# Altium project Kanaloa_v2.0.0_Loko.PrjPcb
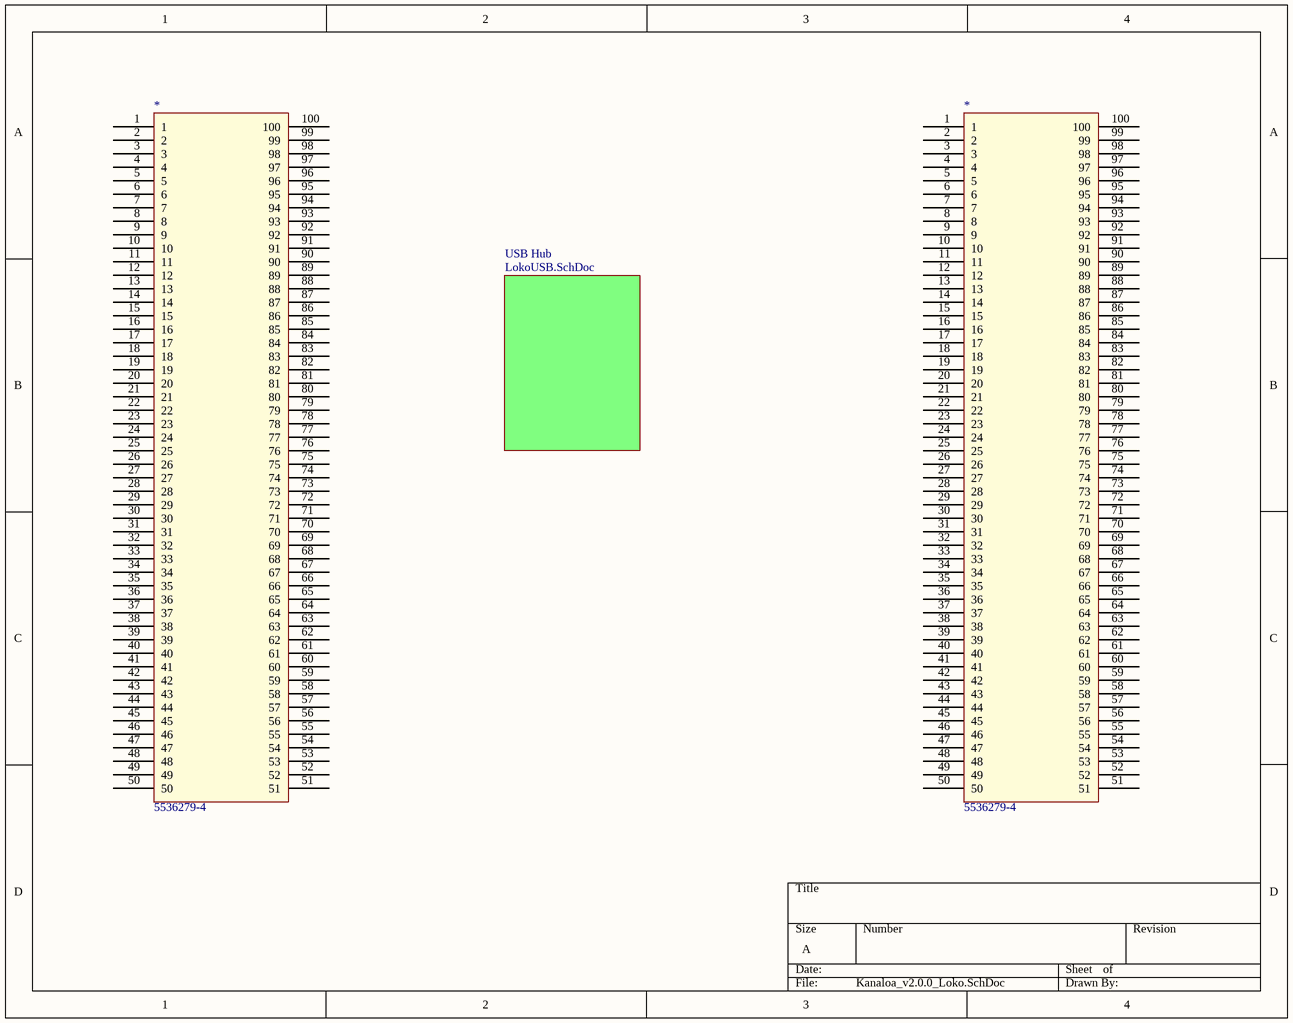
[diagram p0: Kanaloa_v2.0.0_Loko.SchDoc]
2 sheets, 21 parts. Net scope: flat (ports and power ports of the same name join across sheets).
Board file: Kanaloa_v2.0.0_Loko.PcbDoc
Sheets:
  Kanaloa_v2.0.0_Loko.SchDoc
    USB Hub = LokoUSB.SchDoc

## Sheet Kanaloa_v2.0.0_Loko.SchDoc
size A

### Parts
(Parts that share a designator on the sheet are numbered #1, #2 ... from top to bottom, then left to right.)
*#1  5536279-4
*#2  5536279-4

### Sub-sheets
USB Hub = LokoUSB.SchDoc: no entries

### Nets

Not connected (* = marked no-connect by the designer): *#1 1 2 3 4 5 6 7 8 9 10 11 12 13 14 15 16 17 18 19 20 21 22 23 24 25 26 27 28 29 30 31 32 33 34 35 36 37 38 39 40 41 42 43 44 45 46 47 48 49 50 51 52 53 54 55 56 57 58 59 60 61 62 63 64 65 66 67 68 69 70 71 72 73 74 75 76 77 78 79 80 81 82 83 84 85 86 87 88 89 90 91 92 93 94 95 96 97 98 99 100; *#2 1 2 3 4 5 6 7 8 9 10 11 12 13 14 15 16 17 18 19 20 21 22 23 24 25 26 27 28 29 30 31 32 33 34 35 36 37 38 39 40 41 42 43 44 45 46 47 48 49 50 51 52 53 54 55 56 57 58 59 60 61 62 63 64 65 66 67 68 69 70 71 72 73 74 75 76 77 78 79 80 81 82 83 84 85 86 87 88 89 90 91 92 93 94 95 96 97 98 99 100

### Library data of the parts
*#1 *#2 = 5536279-4: female

## Sheet LokoUSB.SchDoc
size Tabloid
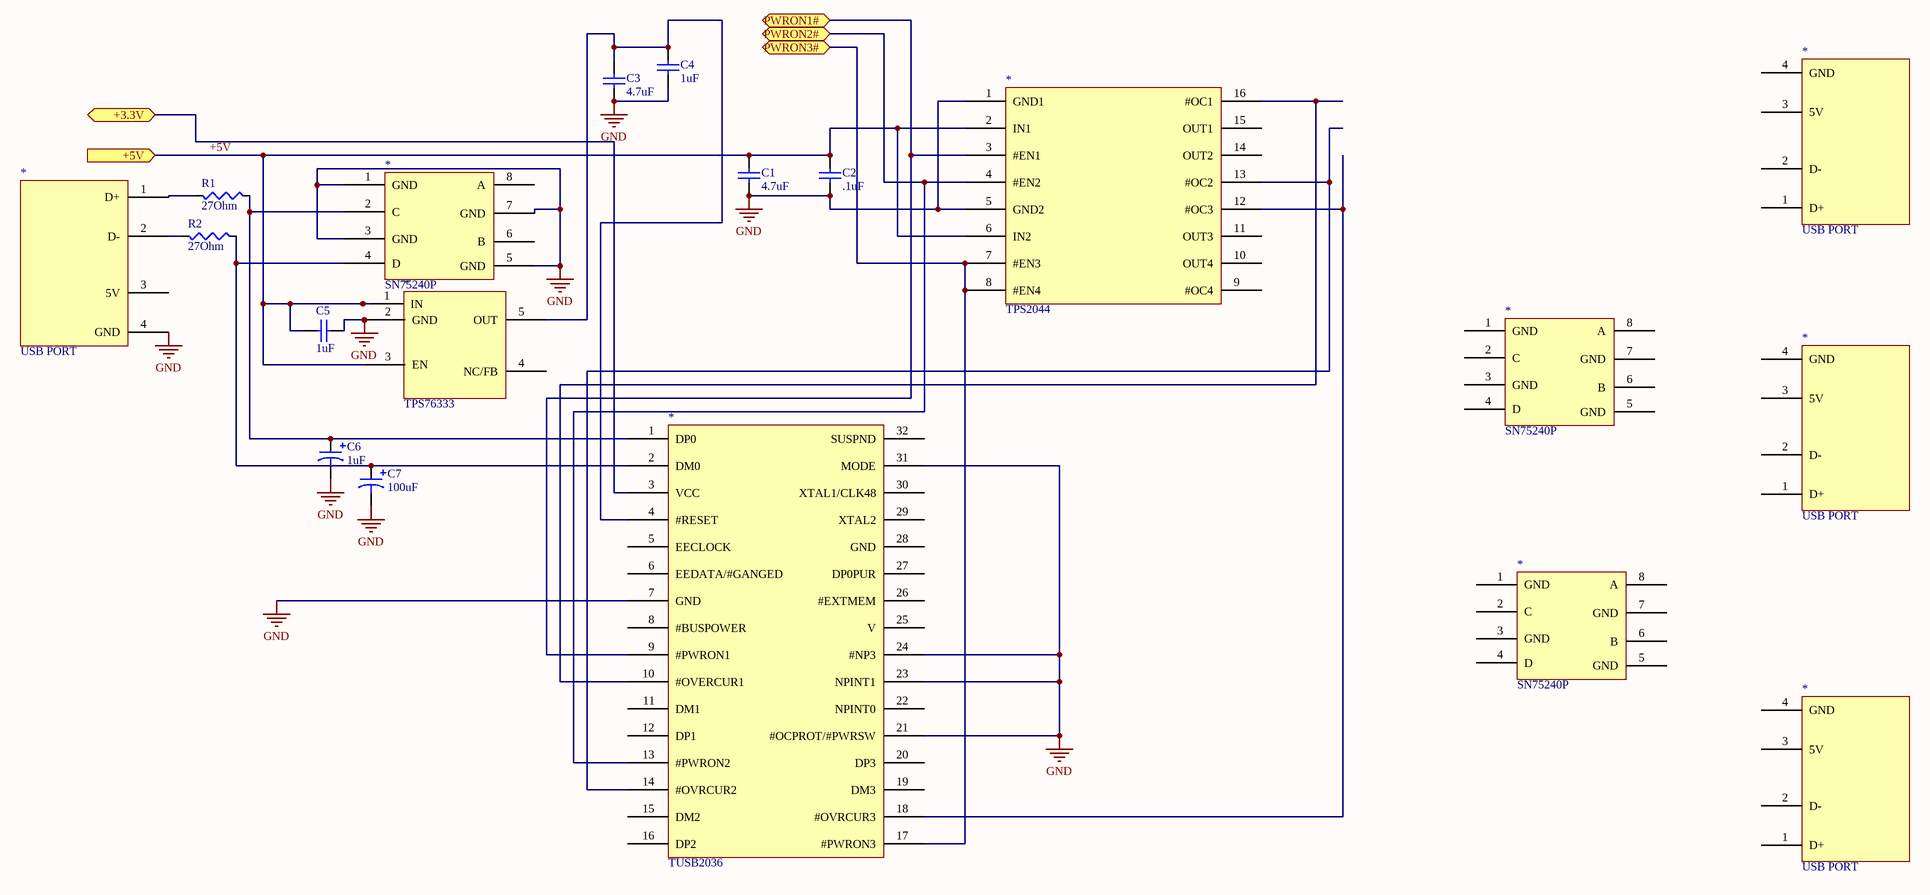
[diagram p1: LokoUSB.SchDoc]

### Parts
(Parts that share a designator on the sheet are numbered #1, #2 ... from top to bottom, then left to right.)
*#3  USB PORT
*#4  TPS2044
*#5  SN75240P
*#6  USB PORT
*#7  TPS76333
*#8  SN75240P
*#9  USB PORT
*#10  SN75240P
*#11  TUSB2036  [TUSB2036]
*#12  USB PORT
C1  4.7uF  [0805 (2012) Capacitor]
C2  .1uF  [0805 (2012) Capacitor]
C3  4.7uF  [0805 (2012) Capacitor]
C4  1uF  [0805 (2012) Capacitor]
C5  1uF  [0805 (2012) Capacitor]
C6  1uF  [Radial (8mm x 15mm, 3.5mm spacing)]
C7  100uF  [Radial (8mm x 15mm, 3.5mm spacing)]
R1  27Ohm  [R 1210 (3225) RESISTOR]
R2  27Ohm  [R 1210 (3225) RESISTOR]

### Ports
+3.3V, +5V (in), PWRON1#, PWRON2#, PWRON3#

### Nets
GND: *#4.1(GND1) *#4.5(GND2) *#5.1(GND) *#5.3(GND) *#5.5(GND) *#5.7(GND) *#6.4(GND) *#7.2(GND) *#11.7(GND) *#11.21(#OCPROT/#PWRSW) *#11.23(NPINT1) *#11.24(#NP3) *#11.31(MODE) C1.1 C2.1 C3.1 C4.1 C5.2 C6.N C7.N
+5V: *#4.2(IN1) *#4.6(IN2) *#7.1(IN) *#7.3(EN) C1.2 C2.2 C5.1 ; port +5V
Net*#4_3: *#4.3(#EN1) *#11.9(#PWRON1) ; port PWRON1#
Net*#4_4: *#4.4(#EN2) *#11.13(#PWRON2) ; port PWRON2#
Net*#4_7: *#4.7(#EN3) *#4.8(#EN4) *#11.17(#PWRON3) ; port PWRON3#
Net*#4_12: *#4.12(#OC3) *#11.18(#OVRCUR3)
Net*#4_13: *#4.13(#OC2) *#11.14(#OVRCUR2)
Net*#4_16: *#4.16(#OC1) *#11.10(#OVERCUR1)
Net*#5_2: *#5.2(C) *#11.1(DP0) C6.P R1.2
Net*#5_4: *#5.4(D) *#11.2(DM0) C7.P R2.2
Net*#6_1: *#6.1(D+) R1.1
Net*#6_2: *#6.2(D-) R2.1
Net*#7_5: *#7.5(OUT) *#11.4(#RESET) C3.2 C4.2
Net*#11_3: *#11.3(VCC) ; port +3.3V

Not connected (* = marked no-connect by the designer): *#3 1(D+) 2(D-) 3(5V) 4(GND); *#4 9(#OC4) 10(OUT4) 11(OUT3) 14(OUT2) 15(OUT1); *#5 6(B) 8(A); *#6 3(5V); *#7 4(NC/FB); *#8 1(GND) 2(C) 3(GND) 4(D) 5(GND) 6(B) 7(GND) 8(A); *#9 1(D+) 2(D-) 3(5V) 4(GND); *#10 1(GND) 2(C) 3(GND) 4(D) 5(GND) 6(B) 7(GND) 8(A); *#11 5(EECLOCK) 6(EEDATA/#GANGED) 8(#BUSPOWER) 11(DM1) 12(DP1) 15(DM2) 16(DP2) 19(DM3) 20(DP3) 22(NPINT0) 25(V) 26(#EXTMEM) 27(DP0PUR) 28(GND) 29(XTAL2) 30(XTAL1/CLK48) 32(SUSPND); *#12 1(D+) 2(D-) 3(5V) 4(GND)

### Library data of the parts
C1 C3-C5 = Capacitor (non-polarized): Capacitor; Value: .1uF
C2 = Capacitor (non-polarized): Capacitor; Value: .1uF
C6 C7 = Capacitor (polarized)
R1 R2 = Resistor: Value: 0Ohm